# EAGLE schematic eagle achema (EAGLE 9.6.1)
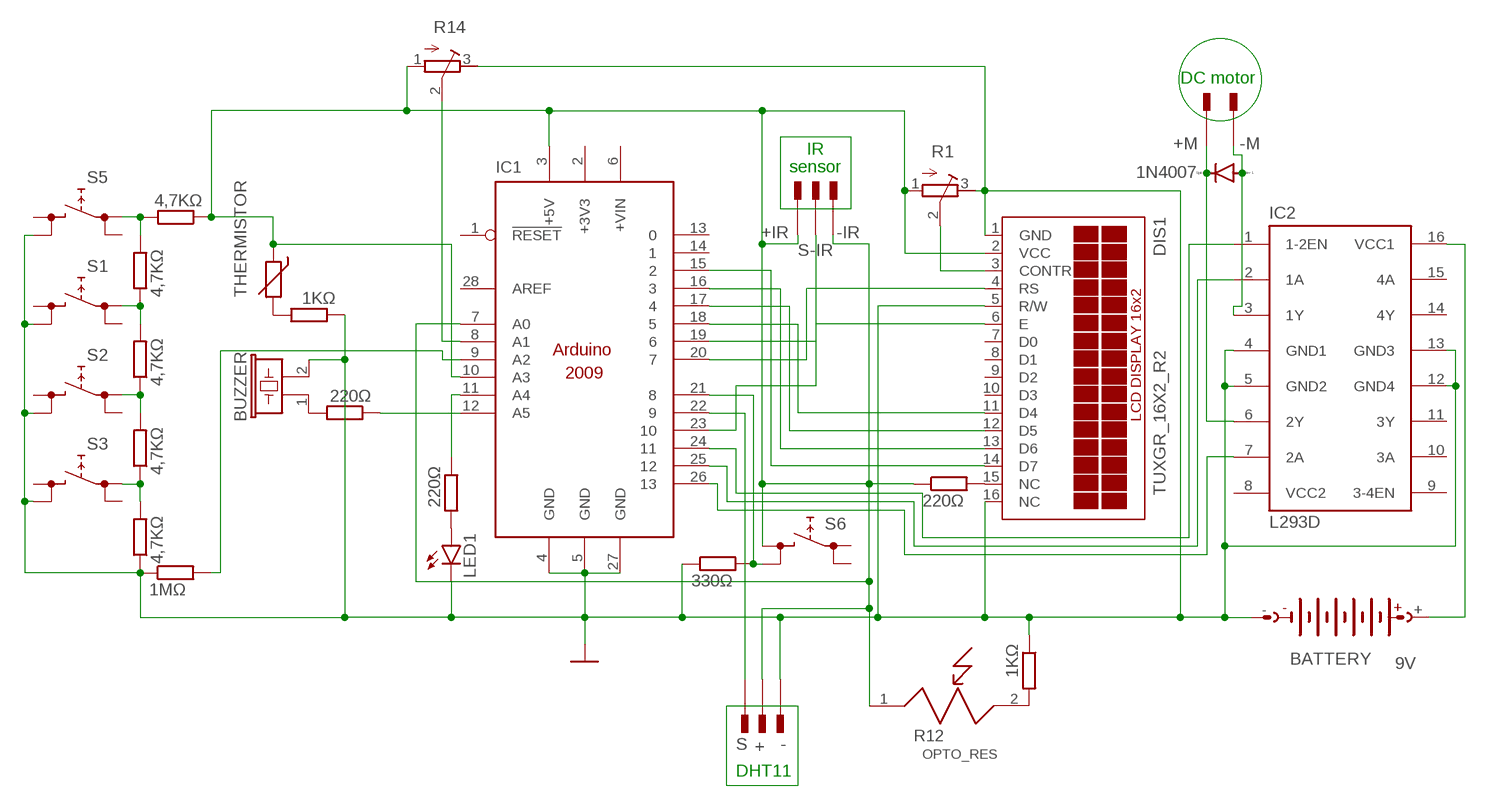
[diagram p0: schematic, sheet 1]

## Parts
1MΩ  1MΩ  R-EU_0207/10  [0207/10]
1N4007  1N4004  [DO41-10]
4,7KΩ  4,7KΩ  R-EU_0207/10  [0207/10]
9V  BATTERY  AB9V  [AB9V]
220Ω  220Ω  R-EU_0207/10  [0207/10]
+  PIN3F061.120  [F061.120]
+IR  PIN3F061.120  [F061.120]
+M  PIN3F061.120  [F061.120]
-  PIN3F061.120  [F061.120]
-IR  PIN3F061.120  [F061.120]
-M  PIN3F061.120  [F061.120]
DIS1  TUXGR_16X2_R2  [TUXGR_16X2_R2]
IC1  ARDUINO2009_10  [ARDUINO2009]
IC2  L293D  [DIL16]
LED1  LED3MM  [LED3MM]
R1  R-TRIMM3339P  [RTRIM3339P]
R2  220Ω  R-EU_0207/10  [0207/10]
R3  1KΩ  R-EU_0207/10  [0207/10]
R6  4,7KΩ  R-EU_0207/10  [0207/10]
R7  4,7KΩ  R-EU_0207/10  [0207/10]
R8  4,7KΩ  R-EU_0207/10  [0207/10]
R9  4,7KΩ  R-EU_0207/10  [0207/10]
R10  220Ω  R-EU_0207/10  [0207/10]
R11  330Ω  R-EU_0207/10  [0207/10]
R12  OPTO_RES  [OPTO_RES]
R13  1KΩ  R-EU_0207/10  [0207/10]
R14  R-TRIMM3339P  [RTRIM3339P]
S  PIN3F061.120  [F061.120]
S1  REKN  [REKN]
S2  REKN  [REKN]
S3  REKN  [REKN]
S5  REKN  [REKN]
S6  REKN  [REKN]
S-IR  PIN3F061.120  [F061.120]
SG1  BUZZER  EFBAA40D101  [EFBAA40D101]
THERMISTOR  THERMISTOR-7,5  [R-7,5]

## Nets
GND: 1MΩ.1 4,7KΩ.1 9V.- -.1A -.1B -.1C DIS1.1(GND) DIS1.5(R/W) DIS1.16(NC) IC1.4(GND) IC1.5(GND) IC1.27(GND) IC2.4(GND1) IC2.5(GND2) IC2.12(GND4) IC2.13(GND3) LED1.K(C) R1.3(E) R3.1 R11.1 R13.1 R14.3(E) S1.1B S2.1B S3.1B S5.1B SG1.2
N$1: DIS1.4(RS) IC1.20
N$2: DIS1.3(CONTR) R1.2(S)
N$3: DIS1.6(E) IC1.19
N$4: DIS1.11(D4) IC1.18
N$5: DIS1.14(D7) IC1.15
N$6: DIS1.12(D5) IC1.17
N$7: DIS1.13(D6) IC1.16
N$8: DIS1.15(NC) R2.2
N$9: 220Ω.1 IC1.12(A5)
N$10: 220Ω.2 SG1.1
N$11: IC1.11(A4) R10.1
N$12: 1MΩ.2 IC1.9(A2)
N$13: LED1.A R10.2
N$14: 4,7KΩ.2 R6.1 S3.0A
N$15: R6.2 R7.1 S2.0A
N$16: R7.2 R8.1 S1.0A
N$17: R8.2 R9.2 S5.0A
N$18: IC1.21 R11.2 S6.1B
N$19: +.1A +.1B +.1C -IR.1A -IR.1B -IR.1C DIS1.2(VCC) IC1.3(+5V) IC1.7(A0) IC1.10(A3) R1.1(A) R2.1 R9.1 R12.1 R14.1(A) S6.1A S-IR.1A S-IR.1B S-IR.1C THERMISTOR.1
N$20: IC1.22 S.1A S.1B S.1C
N$22: R12.2 R13.2
N$23: IC1.8(A1) R14.2(S)
N$24: IC1.24 IC2.1(1-2EN)
N$25: IC1.25 IC2.2(1A)
N$26: 1N4007.A -M.1A -M.1B -M.1C IC2.3(1Y)
N$27: 1N4007.C +M.1A +M.1B +M.1C IC2.6(2Y)
N$28: IC1.26 IC2.7(2A)
N$29: 9V.+ IC2.16(VCC1)
N$31: +IR.1A +IR.1B +IR.1C IC1.23
N$32: R3.2 THERMISTOR.2
Unconnected: DIS1.7(D0) DIS1.8(D1) DIS1.9(D2) DIS1.10(D3) IC1.1(!RESET) IC1.6(+VIN) IC1.13 IC1.14 IC1.28(AREF) IC2.9(3-4EN) IC2.10(3A) IC2.11(3Y) IC2.14(4Y) IC2.15(4A) S1.0B S1.1A S2.0B S2.1A S3.0B S3.1A S5.0B S5.1A S6.0A S6.0B

## Notes on the sheet
- DC motor
- IR
- sensor
- DHT11

## Power pins joined to a net without a drawn wire
+3V3: IC1.2(+3V3)
VCC2: IC2.8(VCC2)

## Library data of the parts
1MΩ 4,7KΩ 220Ω R2 R3 R6-R11 R13 = rcl:R-EU_: RESISTOR, European symbol; SPICEPREFIX: R
1N4007 = diode:1N4004: DIODE general purpose rectifier, 1 A
9V = battery:AB9V: 9-V BATTERY CLIP
+ +IR +M - -IR -M S S-IR = con-faston:PIN3: Flachstecker Typ tyco/Electronics/AMP Printed Circuit Board Tabs Source: http://www.buerklin.com; OC_FARNELL: unknown; OC_NEWARK: unknown
DIS1 = display-lcd:TUXGR_16X2_R2: Tuxgraphics LCD display 16x2 characters reflective, without background light Source: tuxgr_12x2_r2.pdf; OC_FARNELL: unknown; OC_NEWARK: unknown
IC1 = arduino:ARDUINO2009_1: The Arduino Duemilanove ("2009") is a microcontroller board based on the ATmega168 or ATmega328. - 14 digital input/output pins (of which 6 can be used as PWM outputs) - 6 analog inputs, a 16 MHz crystal oscillator - USB connection - power jack - ISP header - reset button It contains everything needed to support the microcontroller; simply connect it to a computer with a USB cable or power it with a AC-to-DC adapter or battery to get started http://arduino.cc/en/Main/ArduinoBoardDuemilanove
IC2 = st-microelectronics:L293D: PUSH-PULL 4 CHANNEL DRIVER; MPN: L293D; OC_FARNELL: 9589619; OC_NEWARK: 56P8249
LED1 = led:LED: LED OSRAM: - CHIPLED LG R971, LG N971, LY N971, LG Q971, LY Q971, LO R971, LY R971 LH N974, LH R974 LS Q976, LO Q976, LY Q976 LO Q996 - Hyper CHIPLED LW Q18S LB Q993, LB Q99A, LB R99A - SideLED LS A670, LO A670, LY A670, LG A670, LP A670 LB A673, LV A673, LT A673, LW A673 LH A674 LY A675 LS A676, LA A676, LO A676, LY A676, LW A676 LS A679, LY A679, LG A679 - Hyper Micro SIDELED® LS Y876, LA Y876, LO Y876, LY Y876 LT Y87S - SmartLED LW L88C, LW L88S LB L89C, LB L89S, LG L890 LS L89K, LO L89K, LY L89K LS L896, LA L896, LO L896, LY L896 - TOPLED LS T670, LO T670, LY T670, LG T670, LP T670 LSG T670, LSP T670, LSY T670, LOP T670, LYG T670 LG T671, LOG T671, LSG T671 LB T673, LV T673, LT T673, LW T673 LH T674 LS T676, LA T676, LO T676, LY T676, LB T676, LH T676, LSB T676, LW T676 LB T67C, LV T67C, LT T67C, LS T67K, LO T67K, LY T67K, LW E67C LS E67B, LA E67B, LO E67B, LY E67B, LB E67C, LV E67C, LT E67C LW T67C LS T679, LY T679, LG T679 LS T770, LO T770, LY T770, LG T770, LP T770 LB T773, LV T773, LT T773, LW T773 LH T774 LS E675, LA E675, LY E675, LS T675 LS T776, LA T776, LO T776, LY T776, LB T776 LHGB T686 LT T68C, LB T68C - Hyper Mini TOPLED® LB M676 - Mini TOPLED Santana® LG M470 LS M47K, LO M47K, LY M47K Source: http://www.osram.convergy.de LUXEON: - LUMILED® LXK2-PW12-R00, LXK2-PW12-S00, LXK2-PW14-U00, LXK2-PW14-V00 LXK2-PM12-R00, LXK2-PM12-S00, LXK2-PM14-U00 LXK2-PE12-Q00, LXK2-PE12-R00, LXK2-PE12-S00, LXK2-PE14-T00, LXK2-PE14-U00 LXK2-PB12-K00, LXK2-PB12-L00, LXK2-PB12-M00, LXK2-PB14-N00, LXK2-PB14-P00, LXK2-PB14-Q00 LXK2-PR12-L00, LXK2-PR12-M00, LXK2-PR14-Q00, LXK2-PR14-R00 LXK2-PD12-Q00, LXK2-PD12-R00, LXK2-PD12-S00 LXK2-PH12-R00, LXK2-PH12-S00 LXK2-PL12-P00, LXK2-PL12-Q00, LXK2-PL12-R00 Source: www.luxeon.com KINGBRIGHT: KA-3528ASYC Source: www.kingbright.com
R1 R14 = rcl:R-TRIMM: Trimm resistor; SPICEMODEL: X; SPICEPREFIXL: POT
R12 = opto-resistor:OPTO_RES
S1-S3 S5 S6 = switch:REKN: PUSH SWITCH ITT-Cannon-Cannon
SG1 = buzzer:EFB?: Piezoelectric Acoustic Transducer Source: Panbasonic .. 2SC1685.pdf; OC_FARNELL: unknown; OC_NEWARK: unknown
THERMISTOR = varistor:THERMISTOR: THERMISTOR